# EAGLE design ukmarsbot-wall-sensor-basic (EAGLE 7.5.0)
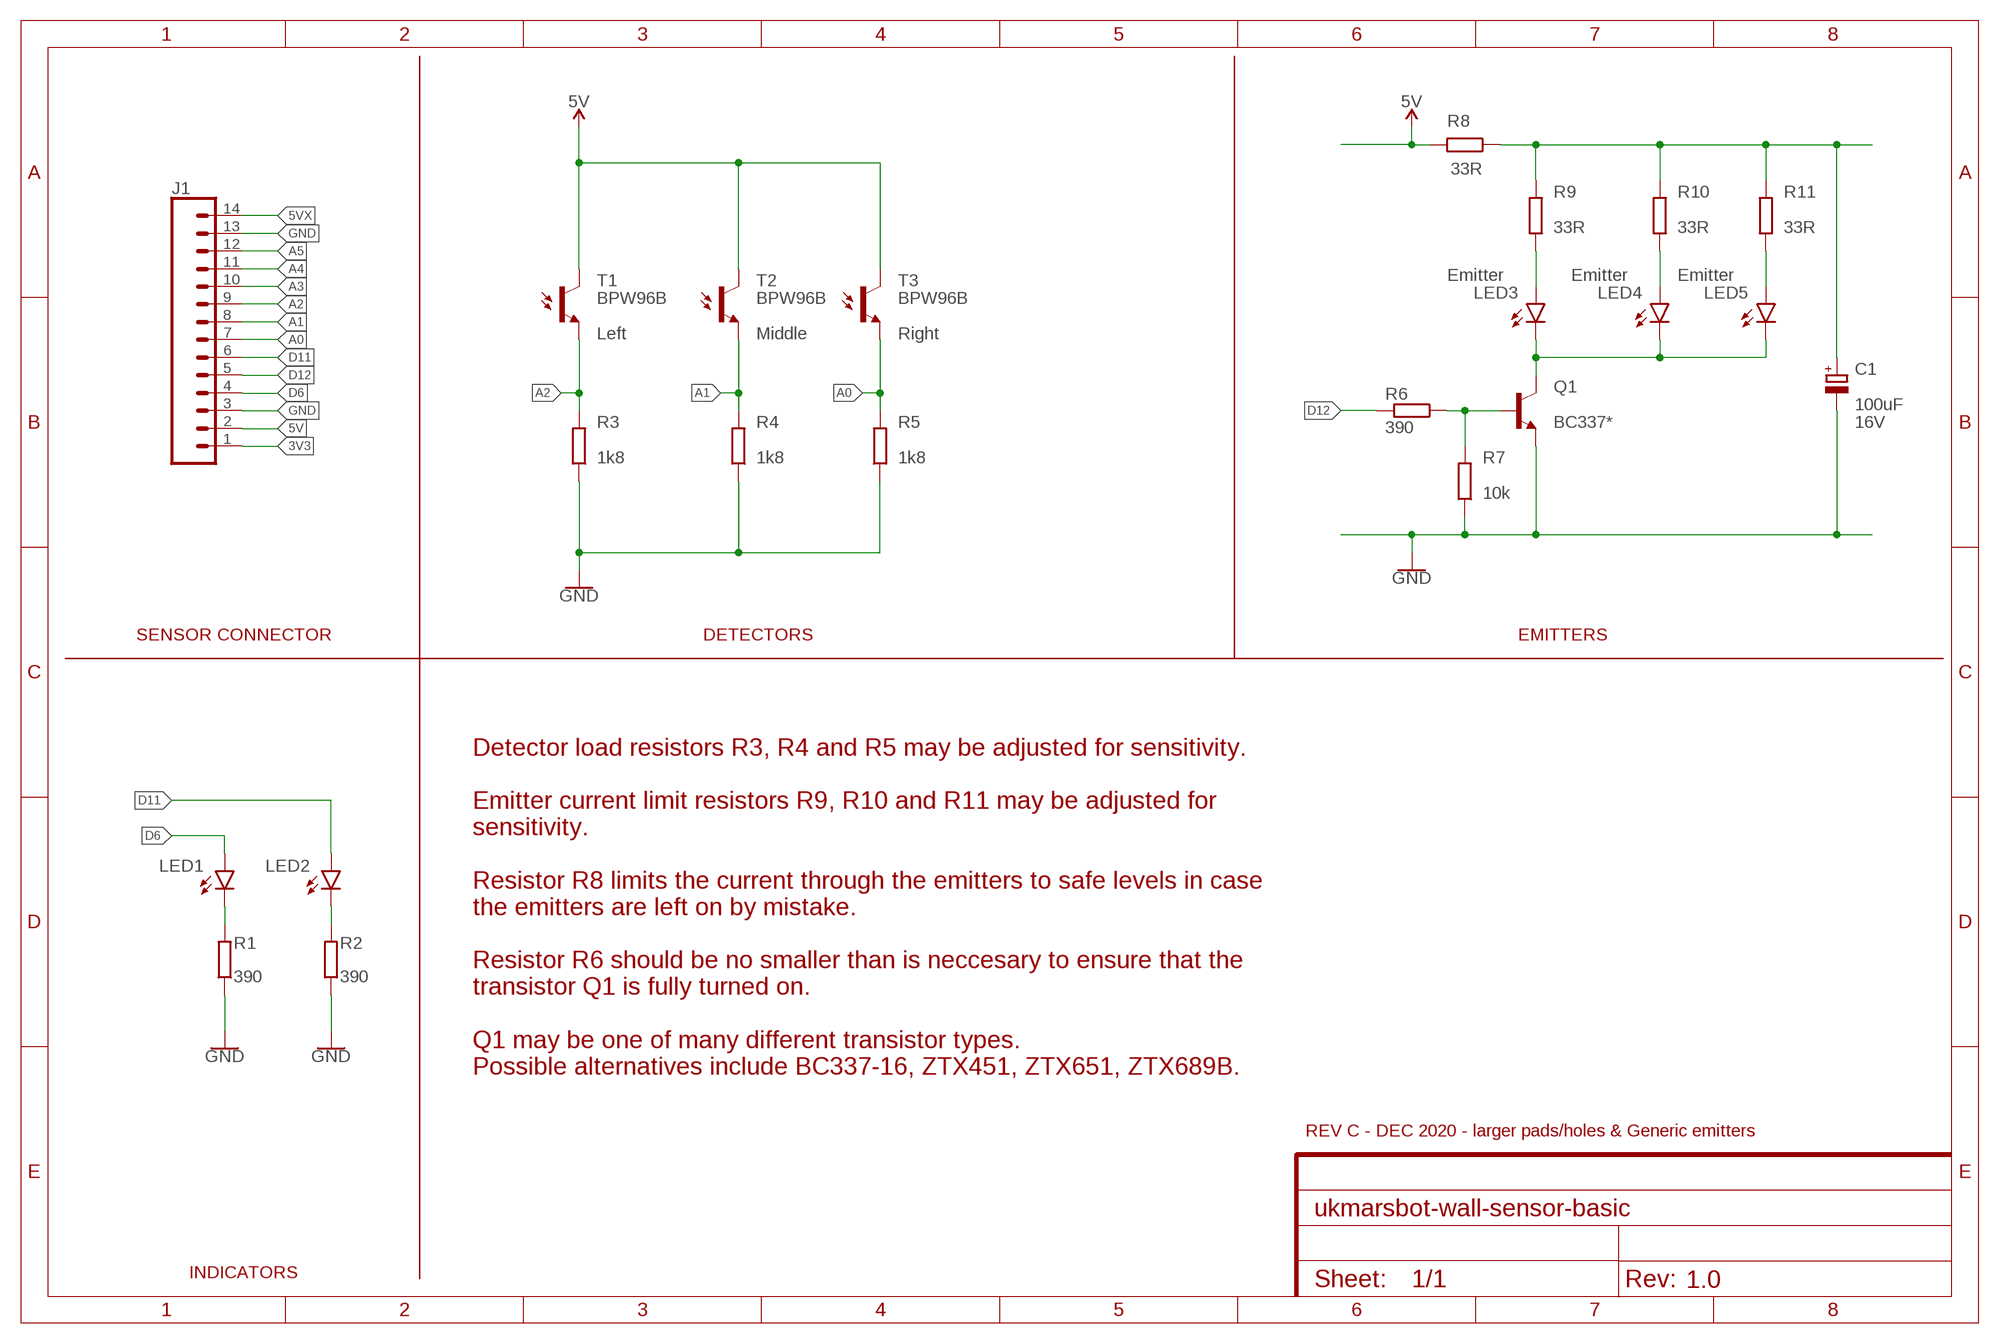
[diagram p0: schematic, sheet 1]
FRAME1 (FRAME-A4L): REV: 1.0

## Parts
C1  100uF  CPOL-EUE2.5-7  [E2,5-7]
J1  CONN_14  [1X14]
LED1  LED3MM  [LED_3MM]
LED2  LED3MM  [LED_3MM]
LED3  Emitter  LED-SIDE  [LED-5MM-SIDE]
LED4  Emitter  LED-SIDE  [LED-5MM-SIDE]
LED5  Emitter  LED-SIDE  [LED-5MM-SIDE]
Q1  BC337*  TRANS_NPN  [TO92-EBC]
R1  390  R-EU_0204/7  [0204/7]
R2  390  R-EU_0204/7  [0204/7]
R3  1k8  R-EU_0204/7  [0204/7]
R4  1k8  R-EU_0204/7  [0204/7]
R5  1k8  R-EU_0204/7  [0204/7]
R6  390  R-EU_0204/7  [0204/7]
R7  10k  R-EU_0204/7  [0204/7]
R8  33R  R-EU_0204/7  [0204/7]
R9  33R  R-EU_0204/7  [0204/7]
R10  33R  R-EU_0204/7  [0204/7]
R11  33R  R-EU_0204/7  [0204/7]
T1  BPW96B  PHOTOTRANSISTORSIDE  [PHOTOTRANSISTOR-5MM-SIDE]
T2  BPW96B  PHOTOTRANSISTORSIDE  [PHOTOTRANSISTOR-5MM-SIDE]
T3  BPW96B  PHOTOTRANSISTORSIDE  [PHOTOTRANSISTOR-5MM-SIDE]

## Nets
3V3: J1.1
5V [power]: J1.2 R8.2 T1.C T2.C T3.C
5VX [power]: J1.14
A0: J1.7 R5.2 T3.E
A1: J1.8 R4.2 T2.E
A2: J1.9 R3.2 T1.E
A3: J1.10
A4: J1.11
A5: J1.12
D6: J1.4 LED1.A
D11: J1.6 LED2.A
D12: J1.5 R6.2
GND [power]: C1.- J1.3 J1.13 Q1.E R1.1 R2.1 R3.1 R4.1 R5.1 R7.1
N$1: LED3.A R9.1
N$2: LED4.A R10.1
N$3: LED2.K(C) R2.2
N$4: LED5.A R11.1
N$5 [power]: LED3.K(C) LED4.K(C) LED5.K(C) Q1.C
N$6: Q1.B R6.1 R7.2
N$7: LED1.K(C) R1.2
N$8 [power]: C1.+ R8.1 R9.2 R10.2 R11.2

## Notes on the sheet
- SENSOR CONNECTOR | DETECTORS | EMITTERS
- Detector load resistors R3, R4 and R5 may be adjusted for sensitivity.
  
  Emitter current limit resistors R9, R10 and R11 may be adjusted for 
  sensitivity.
  
  Resistor R8 limits the current through the emitters to safe levels in case
  the emitters are left on by mistake.
  
  Resistor R6 should be no smaller than is neccesary to ensure that the 
  transistor Q1 is fully turned on.
  
  Q1 may be one of many different transistor types. 
  Possible alternatives include BC337-16, ZTX451, ZTX651, ZTX689B.
- REV C - DEC 2020 - larger pads/holes & Generic emitters
- INDICATORS

## Library data of the parts
C1 = ukmarsbot:CPOL-EU: POLARIZED CAPACITOR, European symbol; VOLTAGE: 16V
J1 = ukmarsbot:CONN_14: Multi connection point. Often used as Generic Header-pin footprint for 0.1 inch spaced/style header connections On any of the 0.1 inch spaced packages, you can populate with these: Break Away Headers - Straight <https://www.sparkfun.com/products/116> (PRT-00116) Break Away Male Headers - Right Angle <https://www.sparkfun.com/products/553> (PRT-00553) Female Headers <https://www.sparkfun.com/products/115> (PRT-00115) Break Away Headers - Machine Pin <https://www.sparkfun.com/products/117> (PRT-00117) Break Away Female Headers - Swiss Machine Pin <https://www.sparkfun.com/products/743> (PRT-00743) For SCREWTERMINALS and SPRING TERMINALS visit here: Screw Terimnals on SparkFun.com <https://www.sparkfun.com/search/results?term=Screw+Terminals> (5mm/3.5mm/2.54mm spacing) This device is also useful as a general connection point to wire up your design to another part of your project. Our various solder wires solder well into these plated through hole pads. Hook-Up Wire - Assortment (Stranded, 22 AWG) <https://www.sparkfun.com/products/11375> (PRT-11375) Hook-Up Wire - Assortment (Solid Core, 22 AWG) <https://www.sparkfun.com/products/11367> (PRT-11367) View the entire wire category on our website here <https://www.sparkfun.com/categories/141> Special notes: Molex polarized connector foot print use with SKU : PRT-08231 with associated crimp pins and housings. 1MM SMD Version SKU: PRT-10208 NOTES ON THE VARIANTS LOCK and LOCK_LONGPADS... This footprint was designed to help hold the alignment of a through-hole component (i.e. 6-pin header) while soldering it into place. You may notice that each hole has been shifted either up or down by 0.005 of an inch from it's more standard position (which is a perfectly straight line). This slight alteration caused the pins (the squares in the middle) to touch the edges of the holes. Because they are alternating, it causes a "brace" to hold the component in place. 0.005 has proven to be the perfect amount of "off-center" position when using our standard breakaway headers. Although looks a little odd when you look at the bare footprint, once you have a header in there, the alteration is very hard to notice. Also,if you push a header all the way into place, it is covered up entirely on the bottom side.
LED1 LED2 = ukmarsbot:LED: LED (Generic) Standard schematic elements and footprints for 5mm, 3mm, 1206, and 0603 sized LEDs. Generic LEDs with no color specified.; PROD_ID: DIO-08794
LED3-LED5 = ukmarsbot:LED: LED (Generic) Standard schematic elements and footprints for 5mm, 3mm, 1206, and 0603 sized LEDs. Generic LEDs with no color specified.
Q1 = ukmarsbot:TRANS_NPN: NPN transistor Current controlled devices typically used to amplify current or used as a switch. BC547 - COM-08928 <http://www.sparkfun.com/products/8928> (TO-92 45V 100mA) (1.Collector 2.Base 3.Emitter) 2N3904 - COM-00521 <http://www.sparkfun.com/products/521> (TO-92 40V 200mA) (1.Emitter 2.Base 3.Collector) P2N2222A - COM-12852 <http://www.sparkfun.com/products/12852> (TO-92 40V 600mA) (1.Collector 2.Base 3.Emitter)
R1-R11 = ukmarsbot:R-EU_: RESISTOR
T1 = ukmarsbot:PHOTOTRANSISTOR: Phototransistor; POS: Left
T2 = ukmarsbot:PHOTOTRANSISTOR: Phototransistor; POS: Middle
T3 = ukmarsbot:PHOTOTRANSISTOR: Phototransistor; POS: Right

## Net classes
0 default: width 0.406 mm
1 power: width 0.813 mm

## Board
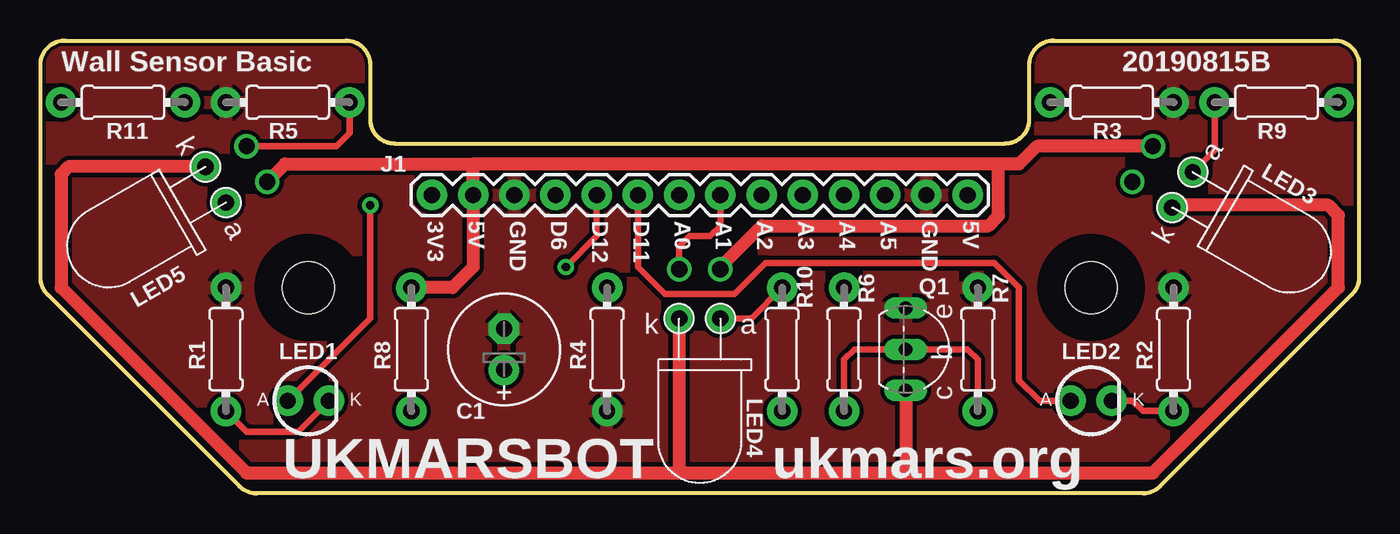
[diagram p1: board, top side]
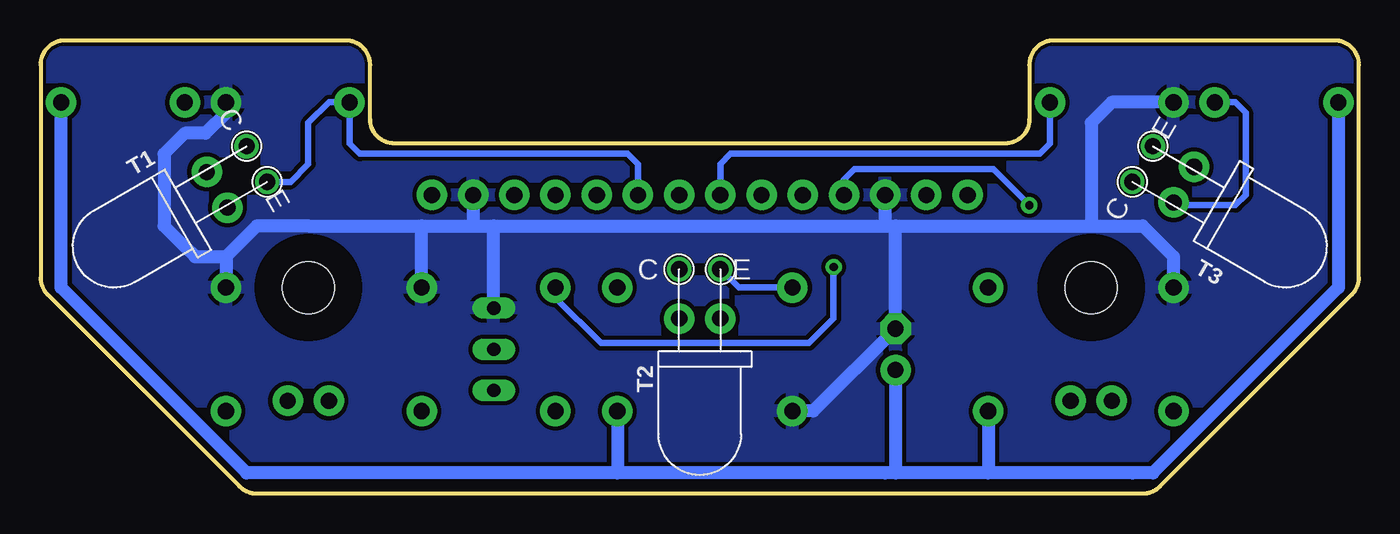
[diagram p2: board, bottom side, seen from below]

Size 81.28 x 27.94 mm. Coordinates in mm from the lower left corner, seen from the top.
Outline: 0,13.32 0,26.44 arc-90 1.5,27.94 18.82,27.94 arc-90 20.32,26.44 20.32,23.09 arc90 21.82,21.59 59.46,21.59 arc90 60.96,23.09 60.96,26.44 arc-90 62.46,27.94 79.78,27.94 arc-90 81.28,26.44 81.28,13.32 arc-45 80.84,12.26 69.02,0.44 arc-45 67.96,0 13.32,0 arc-45 12.26,0.44 0.44,12.26 arc-45 0,13.32
Copper layers (1*16): Top 0.035mm / dielectric 1.5mm / Bottom 0.035mm
Design rules "SparkFun-2-layer-STANDARD": minimum track width 10mil, minimum drill 20mil, track to track 10mil, track to pad 8mil, pad to pad 8mil, via to via 10mil, smd to smd 8mil, copper to edge 8mil, drill to drill 8mil, minimum pad ring 10mil, minimum via ring 10mil, stop-mask expansion 4mil, vias tented up to drill 25mil, thermal gap 10mil
Holes 3.2 mm at 16.51,12.7 64.77,12.7
tRestrict: area 13.3,9.5 to 19.7,15.9; area 61.6,9.5 to 67.9,15.9
bRestrict: area 13.3,9.5 to 19.7,15.9; area 61.6,9.5 to 67.9,15.9

### Footprints (pad centres in the part's own frame; a part is rotated, then mirrored left to right if it is on the bottom)
E2,5-7 = drill 1 pad 1.88: + -1.27,0 | drill 1 pad 1.88 octagon: - 1.27,0
1X14 = drill 1 pad 1.88: 1 0,0; 2 2.54,0; 3 5.08,0; 4 7.62,0; 5 10.16,0; 6 12.7,0; 7 15.24,0; 8 17.78,0; 9 20.32,0; 10 22.86,0; 11 25.4,0; 12 27.94,0; 13 30.48,0; 14 33.02,0
LED_3MM = drill 1 pad 1.88: A -1.27,0; K 1.27,0
LED-5MM-SIDE = drill 1 pad 1.88: A -1.27,0; K 1.27,0
TO92-EBC = drill 0.813 long: B 0,-1.27; C 2.54,-1.27; E -2.54,-1.27
0204/7 = drill 1 pad 1.88: 1 -3.81,0; 2 3.81,0
PHOTOTRANSISTOR-5MM-SIDE = drill 1: C 1.27,0; E -1.27,0

### Placement (x,y rotation side)
C1  28.58,8.89 90 top
J1  24.13,18.42 0 top
LED1  16.51,5.72 0 top
LED2  64.77,5.72 0 top
LED3  SFH4550  [LED-5MM-SIDE]  70.4,18.73 240 top
LED4  SFH4550  [LED-5MM-SIDE]  40.64,10.8 180 top
LED5  SFH4550  [LED-5MM-SIDE]  10.79,19.05 120 top
Q1  54.61,8.89 270 top
R1  11.43,8.89 270 top
R2  69.85,8.89 270 top
R3  66.04,24.13 180 top
R4  34.92,8.89 90 top
R5  15.24,24.13 0 top
R6  49.53,8.89 90 top
R7  57.78,8.89 270 top
R8  22.86,8.89 90 top
R9  76.2,24.13 0 top
R10  45.72,8.89 270 top
R11  5.08,24.13 180 top
T1  67.94,20.32 120 bottom
T2  40.64,13.84 180 bottom
T3  13.34,20.32 240 bottom

### Tracks (layer width: path | path; a pad name or v marks a point on that pad's centre or on a via)
5V
  Top 0.813: R8.2 25.4,12.7 26.67,13.97 J1.2 26.67,20.32 | T1.C 61.42,21.42 60.33,20.32 59.05,20.32 | 59.05,20.32 26.67,20.32 | T2.C 41.91,13.97 44.45,16.51 58.42,16.51 59.05,17.14 59.05,20.32 | T3.C 15.07,20.32 26.67,20.32
A0
  Top 0.406: T3.E 18.25,21.42 18.41,21.59 19.05,22.23 R5.2
  Bottom 0.406: R5.2 19.05,21.59 19.68,20.95 38.73,20.95 39.37,20.32 J1.7
A1
  Top 0.406: J1.8 41.91,16.51 41.27,15.88 40.01,15.88 39.37,15.24 T2.E
  Bottom 0.406: R4.2 38.23,12.7 T2.E
A2
  Bottom 0.406: J1.9 44.45,20.32 45.09,20.95 61.59,20.95 62.23,21.59 R3.2 63.5,24.13 64.77,22.86 64.77,20.32 65.87,19.22 T1.E
D6  (via drill 0.51)
  Top 0.406: v20.32,17.78 20.32,10.8 15.88,6.35 LED1.A
  Bottom 0.406: J1.4 31.75,19.37 31.12,20 22.54,20 v20.32,17.78
D11
  Top 0.406: J1.6 36.83,13.97 38.48,12.32 42.8,12.32 44.7,14.22 58.8,14.22 60.33,12.7 60.33,6.98 61.59,5.72 LED2.A
D12  (via drill 0.51)
  Top 0.406: J1.5 34.29,15.88 v32.38,13.97
  Bottom 0.406: R6.2 49.53,12.07 46.74,9.28 33.91,9.28 32.38,10.8 v32.38,13.97
GND
  Bottom 0.813: J1.3 29.21,16.51 | 57.78,16.51 54.61,16.51 | 54.61,16.51 53.34,16.51 | 53.34,16.51 29.21,16.51 | Q1.E 53.34,16.51 | R7.1 57.78,16.51 | J1.13 54.61,16.51 | 29.21,16.51 28.58,16.51 | 28.58,16.51 16.51,16.51 | R5.1 15.24,24.13 16.51,22.86 16.51,16.51 | 69.85,14.61 67.94,16.51 64.77,16.51 57.78,16.51 | 69.85,14.61 R2.1 | 16.51,16.51 13.34,16.51 11.43,14.61 R1.1 | R3.1 69.85,23.5 71.12,22.23 72.39,22.23 73.66,20.95 73.66,16.51 72.39,15.24 71.75,14.61 69.85,14.61 | 28.58,16.51 C1.- 33.66,5.08 R4.1
  pour Bottom: 0,27.94 20.32,27.94 20.32,21.59 60.96,21.59 60.96,27.94 81.28,27.94 81.28,12.7 68.58,0 12.7,0 0,12.7
  pour Top: 0,28.58 20.95,28.58 20.95,22.23 60.33,22.23 60.33,28.58 81.92,28.58 81.92,12.07 69.22,-0.63 13.34,-0.63 12.7,-0.63 -0.63,12.7 -0.63,28.58
N$1
  Top 0.406: R9.1 72.39,21.19 LED3.A
N$2
  Top 0.406: LED4.A 43.81,10.8 R10.1
N$3
  Top 0.406: LED2.K 67.31,5.72 67.94,5.08 R2.2
N$4
  Bottom 0.406: R11.1 7.62,24.13 6.98,23.5 6.98,18.42 7.62,17.78 11.26,17.78 LED5.A
N$5
  Top 0.813: LED5.K 1.73,20.15 1.27,19.69 1.27,12.7 12.7,1.27 39.37,1.27 | 39.37,1.27 53.34,1.27 | 53.34,1.27 68.58,1.27 80.01,12.7 80.01,17.14 79.38,17.78 69.91,17.78 LED3.K | Q1.C 53.34,1.27 | LED4.K 39.37,1.27
N$6
  Top 0.406: R6.1 49.53,8.26 50.16,8.89 Q1.B 57.15,8.89 57.78,8.26 R7.2
N$7
  Top 0.406: R1.2 12.7,3.81 15.88,3.81 LED1.K
N$8
  Bottom 0.813: R11.2 1.27,12.7 12.7,1.27 13.97,1.27 22.86,1.27 | R9.2 80.01,12.7 68.58,1.27 45.72,1.27 | 22.86,1.27 28.58,1.27 | 28.58,1.27 29.21,1.27 45.72,1.27 | R10.2 45.72,1.27 | R8.1 22.86,1.27 | C1.+ 28.58,1.27

### Text on the board
tPlace: 3V3 | 5V | GND | D6 | D12 | D11 | A0 | A1 | A2 | A3 | A4 | A5 | GND | 5V
tNames: Wall Sensor Basic | 20190815B | UKMARSBOT | ukmars.org